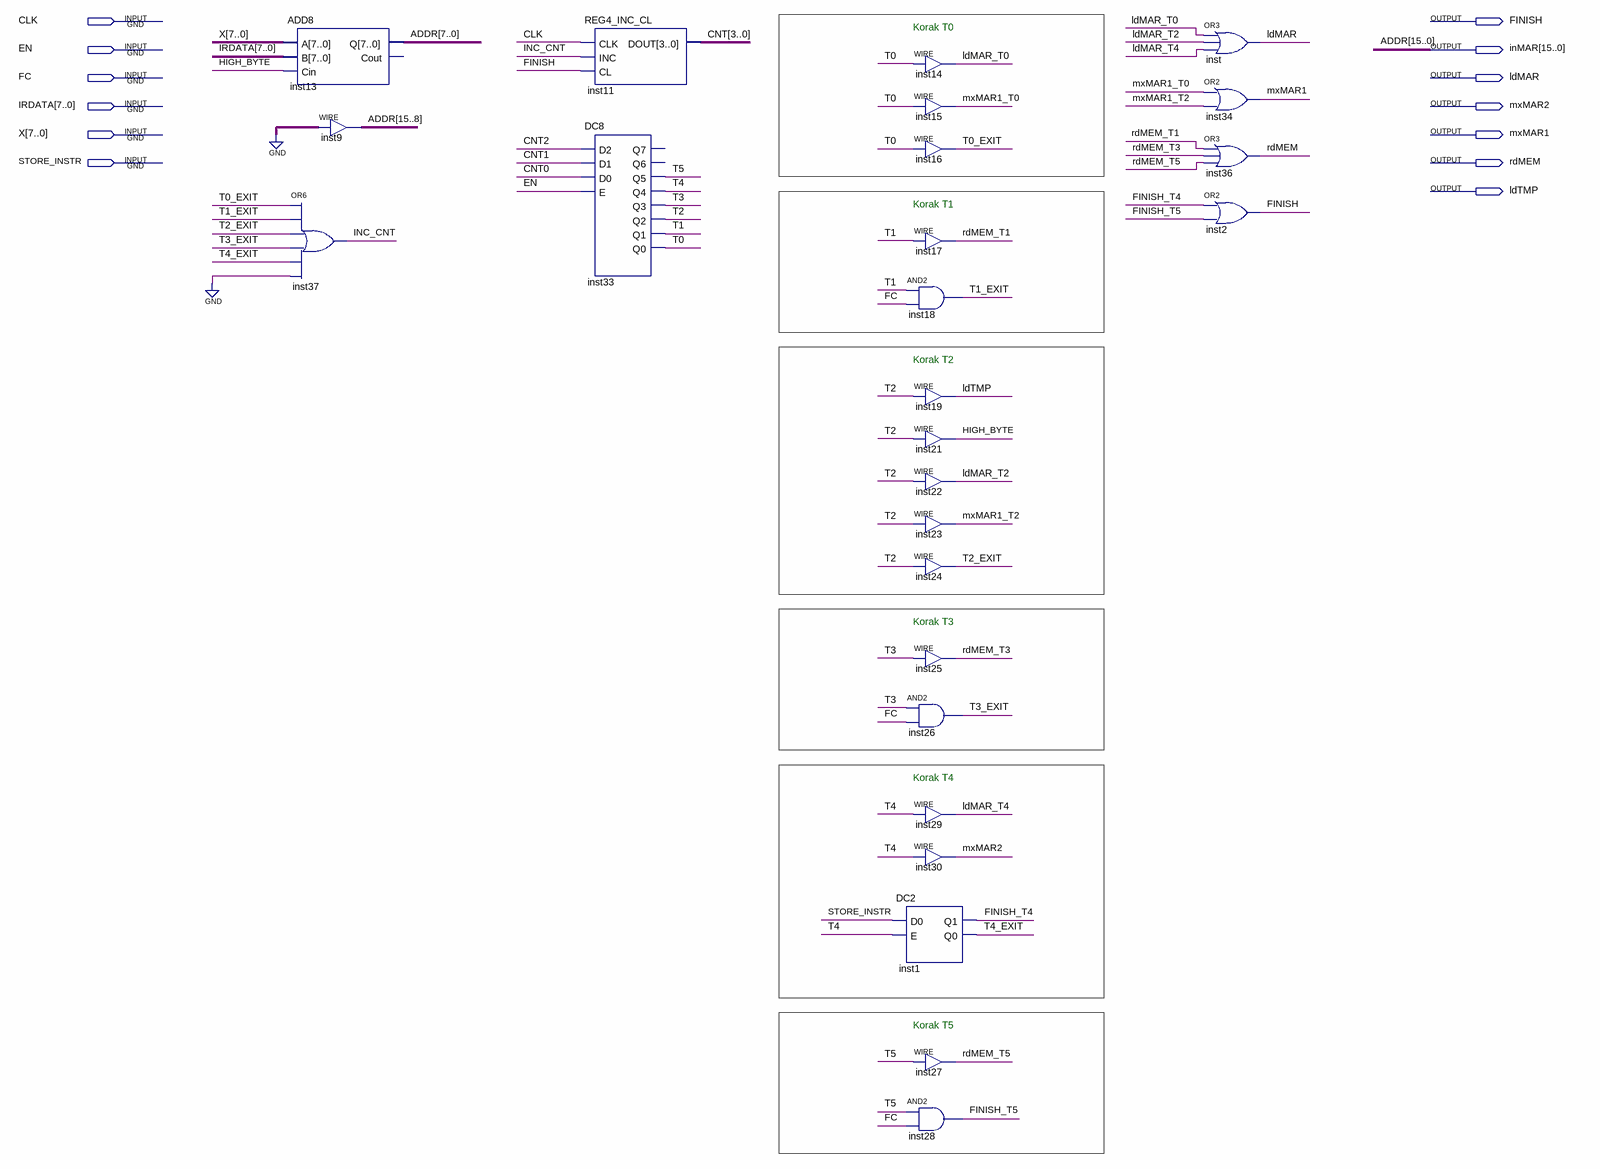
[diagram p0: schematic sheet]
// Quartus schematic idx_ind.bdf as structural Verilog: 26 symbols, 13 pins
module idx_ind (
  input  CLK,
  input  EN,
  input  FC,
  input  [7:0] IRDATA,
  input  [7:0] X,
  input  STORE_INSTR,
  output FINISH,
  output [15:0] inMAR,
  output ldMAR,
  output mxMAR2,
  output mxMAR1,
  output rdMEM,
  output ldTMP
);

  wire FINISH_T4, FINISH_T5, HIGH_BYTE, INC_CNT, ldMAR_T0, ldMAR_T2, ldMAR_T4, mxMAR1_T0, mxMAR1_T2,
       rdMEM_T1, rdMEM_T3, rdMEM_T5, T0, T0_EXIT, T1, T1_EXIT, T2, T2_EXIT, T3, T3_EXIT, T4, T4_EXIT, T5;
  wire [3:0] CNT;

  ADD8 inst13 (.A(X), .B(IRDATA), .Cin(HIGH_BYTE), .Q(inMAR[7:0]));  // open: Cout
  or inst37 (INC_CNT, T0_EXIT, T1_EXIT, T2_EXIT, T3_EXIT, T4_EXIT, 1'b0);
  assign inMAR[15:8] = {8{1'b0}};  // WIRE inst9
  REG4_INC_CL inst11 (.CLK(CLK), .INC(INC_CNT), .CL(FINISH), .DOUT(CNT));
  DC8 inst33 (
    .D2(CNT[2]), .D1(CNT[1]), .D0(CNT[0]), .E(EN), .Q5(T5), .Q4(T4), .Q3(T3), .Q2(T2), .Q1(T1), .Q0(T0));  // open: Q7, Q6
  assign ldMAR_T0 = T0;  // WIRE inst14
  assign mxMAR1_T0 = T0;  // WIRE inst15
  assign T0_EXIT = T0;  // WIRE inst16
  assign rdMEM_T1 = T1;  // WIRE inst17
  and inst18 (T1_EXIT, T1, FC);
  assign ldTMP = T2;  // WIRE inst19
  assign HIGH_BYTE = T2;  // WIRE inst21
  assign ldMAR_T2 = T2;  // WIRE inst22
  assign mxMAR1_T2 = T2;  // WIRE inst23
  assign T2_EXIT = T2;  // WIRE inst24
  assign rdMEM_T3 = T3;  // WIRE inst25
  and inst26 (T3_EXIT, T3, FC);
  assign ldMAR_T4 = T4;  // WIRE inst29
  assign mxMAR2 = T4;  // WIRE inst30
  DC2 inst1 (.D0(STORE_INSTR), .E(T4), .Q1(FINISH_T4), .Q0(T4_EXIT));
  assign rdMEM_T5 = T5;  // WIRE inst27
  and inst28 (FINISH_T5, T5, FC);
  or inst (ldMAR, ldMAR_T0, ldMAR_T2, ldMAR_T4);
  or inst34 (mxMAR1, mxMAR1_T0, mxMAR1_T2);
  or inst36 (rdMEM, rdMEM_T1, rdMEM_T3, rdMEM_T5);
  or inst2 (FINISH, FINISH_T4, FINISH_T5);

  // Other names for the same wires on the sheet: ADDR[15:0] = inMAR

  // Notes on the sheet:
  //   Korak T0
  //   Korak T1
  //   Korak T2
  //   Korak T3
  //   Korak T4
  //   Korak T5
endmodule
